# Altium project Modulo Servo.PrjPcb
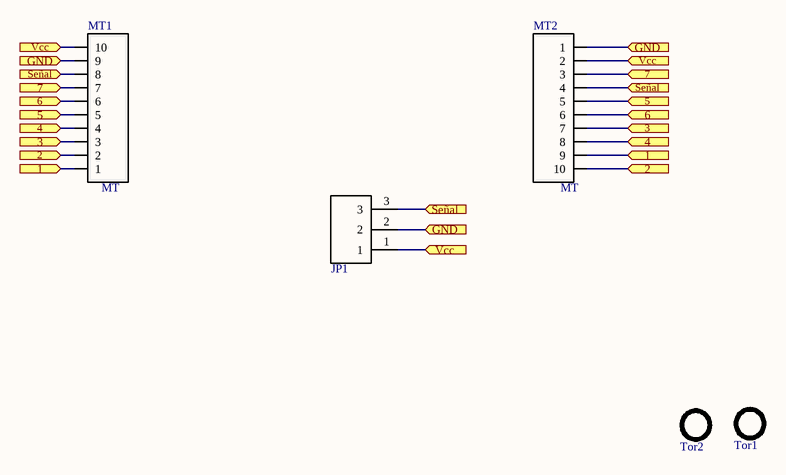
[diagram p0: Modulo Servo.SchDoc]
1 sheet, 5 parts. Net scope: flat (ports and power ports of the same name join across sheets).
Board file: Modulo Servo.PcbDoc

## Sheet Modulo Servo.SchDoc
size A4

### Parts
JP1  Pines (3X2.54)  [Pin(3X2.54mm)]  (value not drawn)
MT1  MT  [Micro-MaTch Famale 1.27mm/SMD]
MT2  MT  [Micro-MaTch Famale 1.27mm/SMD]
Tor1  Tornillo3MM  [Taladro_3mm]  (value not drawn)
Tor2  Tornillo3MM  [Taladro_3mm]  (value not drawn)

### Ports
1 (in), 2 (in), 3 (in), 4 (in), 5 (in), 6 (in), 7 (in), GND (in), Señal (in), Vcc (in)

### Nets
NetJP1_1: JP1.1 MT1.10 MT2.2 ; port Vcc
NetJP1_2: JP1.2 MT1.9 MT2.1 ; port GND
NetJP1_3: JP1.3 MT1.8 MT2.4 ; port Señal
NetMT1_1: MT1.1 MT2.9 ; port 1
NetMT1_2: MT1.2 MT2.10 ; port 2
NetMT1_3: MT1.3 MT2.7 ; port 3
NetMT1_4: MT1.4 MT2.8 ; port 4
NetMT1_5: MT1.5 MT2.5 ; port 5
NetMT1_6: MT1.6 MT2.6 ; port 6
NetMT1_7: MT1.7 MT2.3 ; port 7

### Library data of the parts
MT1 MT2 = Micro-MaTch Famale 1.27mm: Micro-MaTch Famale 1.27mm T/Hole
Tor1 Tor2 = Taladro_3mm